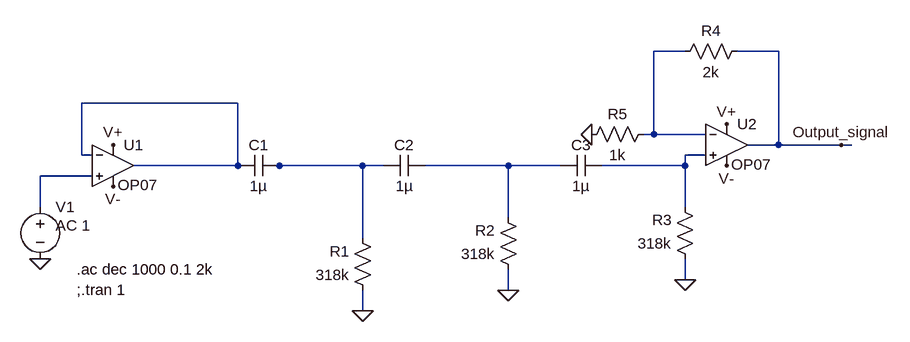
[diagram p0: schematic HPF.asc]
HPF.asc, the LTspice schematic file:
Version 4.1
SHEET 1 880 680
WIRE 368 -80 320 -80
WIRE 512 -80 448 -80
WIRE -320 0 -560 0
WIRE 320 48 320 -80
WIRE 320 48 304 48
WIRE 400 48 320 48
WIRE 512 64 512 -80
WIRE 512 64 464 64
WIRE 608 64 512 64
WIRE 624 64 608 64
WIRE -560 80 -560 0
WIRE -544 80 -560 80
WIRE 400 80 368 80
WIRE -320 96 -320 0
WIRE -320 96 -480 96
WIRE -304 96 -320 96
WIRE -256 96 -272 96
WIRE -128 96 -256 96
WIRE -96 96 -128 96
WIRE 96 96 -32 96
WIRE 176 96 96 96
WIRE 368 96 368 80
WIRE 368 96 240 96
WIRE -544 112 -624 112
WIRE -624 160 -624 112
WIRE 368 160 368 96
WIRE 96 176 96 96
WIRE -128 208 -128 96
WIRE 368 272 368 240
WIRE 96 288 96 256
WIRE -128 320 -128 288
FLAG -512 64 V+
FLAG -512 128 V-
FLAG -128 320 0
FLAG 96 288 0
FLAG 368 272 0
FLAG 432 32 V+
FLAG 432 96 V-
FLAG 224 48 0
FLAG 608 64 Output_signal
FLAG -624 240 0
SYMBOL OpAmps\\OP07 -512 32 R0
WINDOW 3 7 94 Left 2
SYMATTR InstName U1
SYMBOL cap -256 80 R90
WINDOW 0 0 32 VBottom 2
WINDOW 3 32 32 VTop 2
SYMATTR InstName C1
SYMATTR Value 1µ
SYMBOL res -112 304 R180
WINDOW 0 36 76 Left 2
WINDOW 3 36 40 Left 2
SYMATTR InstName R1
SYMATTR Value 318k
SYMBOL res 112 272 R180
WINDOW 0 36 76 Left 2
WINDOW 3 36 40 Left 2
SYMATTR InstName R2
SYMATTR Value 318k
SYMBOL cap -32 80 R90
WINDOW 0 0 32 VBottom 2
WINDOW 3 32 32 VTop 2
SYMATTR InstName C2
SYMATTR Value 1µ
SYMBOL res 384 256 R180
WINDOW 0 36 76 Left 2
WINDOW 3 36 40 Left 2
SYMATTR InstName R3
SYMATTR Value 318k
SYMBOL cap 240 80 R90
WINDOW 0 0 32 VBottom 2
WINDOW 3 32 32 VTop 2
SYMATTR InstName C3
SYMATTR Value 1µ
SYMBOL OpAmps\\OP07 432 0 R0
WINDOW 3 7 94 Left 2
SYMATTR InstName U2
SYMBOL res 464 -96 R90
WINDOW 0 0 56 VBottom 2
WINDOW 3 32 56 VTop 2
SYMATTR InstName R4
SYMATTR Value 2k
SYMBOL res 320 32 R90
WINDOW 0 0 56 VBottom 2
WINDOW 3 32 56 VTop 2
SYMATTR InstName R5
SYMATTR Value 1k
SYMBOL voltage -624 144 R0
WINDOW 123 24 44 Left 2
WINDOW 39 0 0 Left 0
SYMATTR InstName V1
SYMATTR Value ""
SYMATTR Value2 AC 1
TEXT -568 256 Left 2 !.ac dec 1000 0.1 2k\n;.tran 1

The netlist it stands for:
* HPF.asc
X§U1 N006 N002 V+ V- N002 LT1001  ; OP07, pins In+ In- V+ V- OUT
C1 N004 N002 1µ
R1 0 N004 318k
R2 0 N005 318k
C2 N005 N004 1µ
R3 0 N003 318k
C3 N003 N005 1µ
X§U2 N003 N001 V+ V- Output_signal LT1001  ; OP07, pins In+ In- V+ V- OUT
R4 Output_signal N001 2k
R5 N001 0 1k
V1 N006 0 AC 1
.ac dec 1000 0.1 2k
;.tran 1
.lib LTC.lib
.backanno
.end